# Altium schematic sheet PCAL9539A_16-bit_Port_Expander.SchDoc: PCAL9539A 16-bit Port Expander
size A4
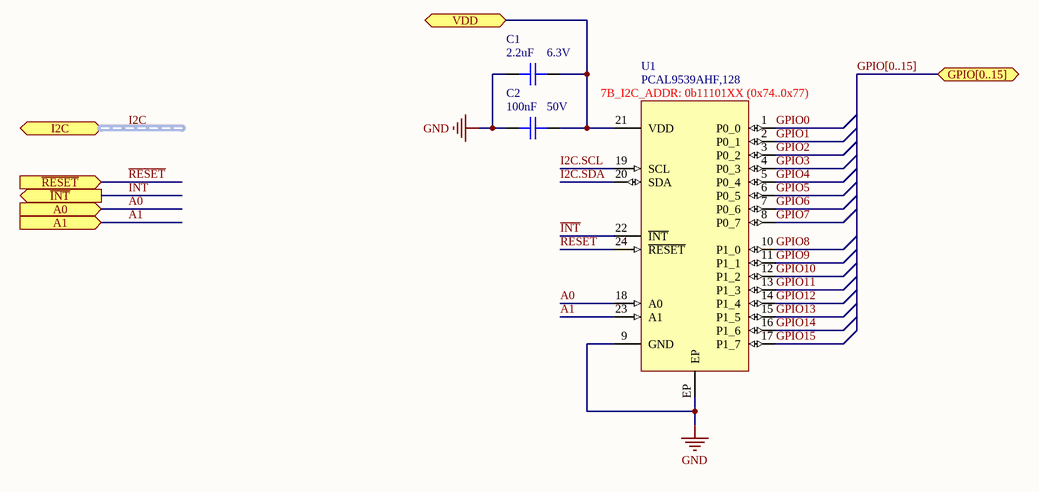
[diagram p0: PCAL9539A_16-bit_Port_Expander.SchDoc]

## Parts
C1  Capacitance: 2.2uF  Voltage: 6.3V  [C0402]  (hidden comment: CAP CER 2.2UF 6.3V X5R 0402)
C2  Capacitance: 100nF  Voltage: 50V  [C0402]  (hidden comment: CAP CER 0.1UF 50V X7R 0402)
U1  PCAL9539AHF,128  7B_I2C_ADDR: 0b11101XX (0x74..0x77)  [QFN-EP 24]

## Ports
A0 (in), A1 (in), GPIO[0..15] (bidir), I2C (harness I2C), VDD, ~{INT} (out), ~{RESET} (in)

## Nets
GND: C1.2 C2.2 U1.9(GND) U1.EP
~{INT}: U1.22(~{INT}) ; port ~{INT}
~{RESET}: U1.24(~{RESET}) ; port ~{RESET}
A0: U1.18(A0) ; port A0
A1: U1.23(A1) ; port A1
GPIO0: U1.1(P0_0)
GPIO1: U1.2(P0_1)
GPIO2: U1.3(P0_2)
GPIO3: U1.4(P0_3)
GPIO4: U1.5(P0_4)
GPIO5: U1.6(P0_5)
GPIO6: U1.7(P0_6)
GPIO7: U1.8(P0_7)
GPIO8: U1.10(P1_0)
GPIO9: U1.11(P1_1)
GPIO10: U1.12(P1_2)
GPIO11: U1.13(P1_3)
GPIO12: U1.14(P1_4)
GPIO13: U1.15(P1_5)
GPIO14: U1.16(P1_6)
GPIO15: U1.17(P1_7)
I2C.SCL: U1.19(SCL)
I2C.SDA: U1.20(SDA)
VDD: C1.1 C2.1 U1.21(VDD) ; port VDD

## Buses and harness runs
bus GPIO[0..15] = port GPIO[0..15]
harness I2C = port I2C

## Notes on the sheet
- Title
- Size:
- Date:
- A4
- Number:
- Time:
- Revision:
- Sheet
- of
- File:

## Library data of the parts
C1 = CAP CER 2.2UF 6.3V X5R 0402: 2.2µF ±20% 6.3V Ceramic Capacitor X5R 0402 (1005 Metric); Manufacturer: Murata; Manufacturer Part Number: GRM155R60J225ME15D; Supplier 1: Digi-Key; Stock 1: 4444410; Pricing 1: 1=0.29, 10=0.199, 100=0.1009, 500=0.0691, 1000=0.0611, 2500=0.0584, 5000=0.0531 (USD); Mount: Surface Mount; Case/Package: 0402; Case Code (Metric): 1005; Case Code (Imperial): 0402; Min Operating Temperature: -55°C; Max Operating Temperature: 85°C; Packaging: Tape and Reel; Voltage Rating: 6.3V; Tolerance: 20%; Dielectric: X5R; Voltage Rating (DC): 6.3V; Package Quantity: 10000; Termination: SMD/SMT; Length: 1mm; Height: 0.5mm; Width: 0.02inch; Thickness: 0.022inch; Supplier Part Number 1: 490-4519-1-ND; Material: Ceramic; Depth: 0.5mm; Radiation Hardening: No; REACH SVHC: No SVHC; Lead Free: Lead Free; ComponentLink1URL: https://www.murata.com/~/media/webrenewal/support/library/catalog/products/capacitor/mlcc/c02e.ashx?la=en-us&src-supplier=Digi-Key; ComponentLink1Description: https://www.murata.com/~/media/webrenewal/support/library/catalog/products/capacitor/mlcc/c02e.ashx?la=en-us&src-supplier=Digi-Key; ComponentLink2URL: http://www.murata.com/~/media/webrenewal/support/library/catalog/products/capacitor/mlcc/c02e.ashx?src-supplier=Avnet; ComponentLink2Description: http://www.murata.com/~/media/webrenewal/support/library/catalog/products/capacitor/mlcc/c02e.ashx?src-supplier=Avnet; ComponentLink3URL: http://www.farnell.com/datasheets/2047859.pdf?src-supplier=Element14; ComponentLink3Description: http://www.farnell.com/datasheets/2047859.pdf?src-supplier=Element14; ComponentLink4URL: https://produktinfo.conrad.com/datenblaetter/450000-474999/450128-da-01-de-VS_KONDENS_GRM155_R60J_225ME15D.pdf?src-supplier=Conrad; ComponentLink4Description: https://produktinfo.conrad.com/datenblaetter/450000-474999/450128-da-01-de-VS_KONDENS_GRM155_R60J_225ME15D.pdf?src-supplier=Conrad
C2 = CAP CER 0.1UF 50V X7R 0402: 0.1µF ±10% 50V Ceramic Capacitor X7R 0402 (1005 Metric); Manufacturer: TDK; Manufacturer Part Number: CGA2B3X7R1H104K050BB; Supplier 1: Digi-Key; Supplier Part Number 1: 445-6899-1-ND; Stock 1: 2925303; Pricing 1: 1=0.17, 10=0.118, 50=0.0668, 100=0.0553, 500=0.0388, 1000=0.0321, 2500=0.0299, 5000=0.0273 (USD); Mount: Surface Mount; Case/Package: 0402; Weight: 2.3E-05oz; Case Code (Metric): 1005; Case Code (Imperial): 0402; Min Operating Temperature: -55°C; Max Operating Temperature: 125°C; Voltage Rating: 50V; Tolerance: 10%; Packaging: Tape and Reel; Package Quantity: 1; Voltage Rating (DC): 50V; Dielectric: X7R; Termination: SMD/SMT; Composition: Ceramic; Length: 1mm; Height: 0.5mm; Width: 0.02inch; Thickness: 0.022inch; Depth: 0.5mm; Ratings: AEC-Q200; REACH SVHC: No SVHC; Lead Free: Lead Free; ComponentLink1URL: http://product.tdk.com/capacitor/mlcc/en/documents/mlccspec_automotive_general_midvoltage_en.pdf?src-supplier=Future+Electronics; ComponentLink1Description: http://product.tdk.com/capacitor/mlcc/en/documents/mlccspec_automotive_general_midvoltage_en.pdf?src-supplier=Future+Electronics; ComponentLink2URL: http://www.farnell.com/datasheets/1807242.pdf?src-supplier=Element14; ComponentLink2Description: http://www.farnell.com/datasheets/1807242.pdf?src-supplier=Element14; ComponentLink3URL: http://www.mouser.com/ds/2/400/lcc_automotive_general_en-843974.pdf?src-supplier=Mouser; ComponentLink3Description: http://www.mouser.com/ds/2/400/lcc_automotive_general_en-843974.pdf?src-supplier=Mouser; ComponentLink4URL: http://www.farnell.com/datasheets/1936565.pdf?src-supplier=Element14; ComponentLink4Description: http://www.farnell.com/datasheets/1936565.pdf?src-supplier=Element14; ComponentLink5URL: http://www.farnell.com/datasheets/1735392.pdf?src-supplier=Element14; ComponentLink5Description: http://www.farnell.com/datasheets/1735392.pdf?src-supplier=Element14
U1 = IC PCAL9539AHF,128 I/O EXPANDER 16BIT 24HWQFN: I/O Expander with interrupt and reset 16 I²C 400kHz 24-HWQFN (4x4); Manufacturer: NXP Semiconductors; Input Voltage: 1.65 V to 5.5 V; Output Current: 25 mA; Output Voltage: 6.5 V; Logic Type: I2C, SMBus; Maximum Clock Frequency: 100 kHz; Operating Supply Current: 160 mA; Pd - Power Dissipation: 200 mW; Supplier 1: Mouser; Supplier Part Number 1: 771-PCAL9539AHF,128; ComponentLink1Description: https://www.mouser.com/datasheet/2/302/PCAL9539A-1127729.pdf; ComponentLink1URL: https://www.mouser.com/datasheet/2/302/PCAL9539A-1127729.pdf; Manufacturer Part Number: PCAL9539AHF,128; RoHS: RoHS Compliant; Category: Interface - I/O Expanders; Stock 1: 4265; Pricing 1: 1=2.11, 10=1.79, 100=1.25, 500=1.21, 1000=0.968, 2500=0.932, 6000=0.896 (USD); Package / Case: HWQFN-24; Packaging: Cut Tape; Product: I/O Expanders; Type: I/O Expander; Brand: NXP Semiconductors; Mounting Style: SMD/SMT; Maximum Operating Temperature: + 85 C; Minimum Operating Temperature: - 40 C; Operating Supply Voltage: 1.65 V to 5.5 V; Product Type: I/O Expanders; Standard Pack Qty: 6000; Subcategory: Interface ICs; RoHS - Mouser: Y; Minimum Order Quantity: 1; Reeling: True; Mount: Surface Mount